# Altium schematic sheet Sheet1.SchDoc
size A; SheetNumber: 1; SheetTotal: 3; SPICEModelCacheGCVOIQGJ: <root> / <DocumentId>GCVOIQGJ</DocumentId> / </root>
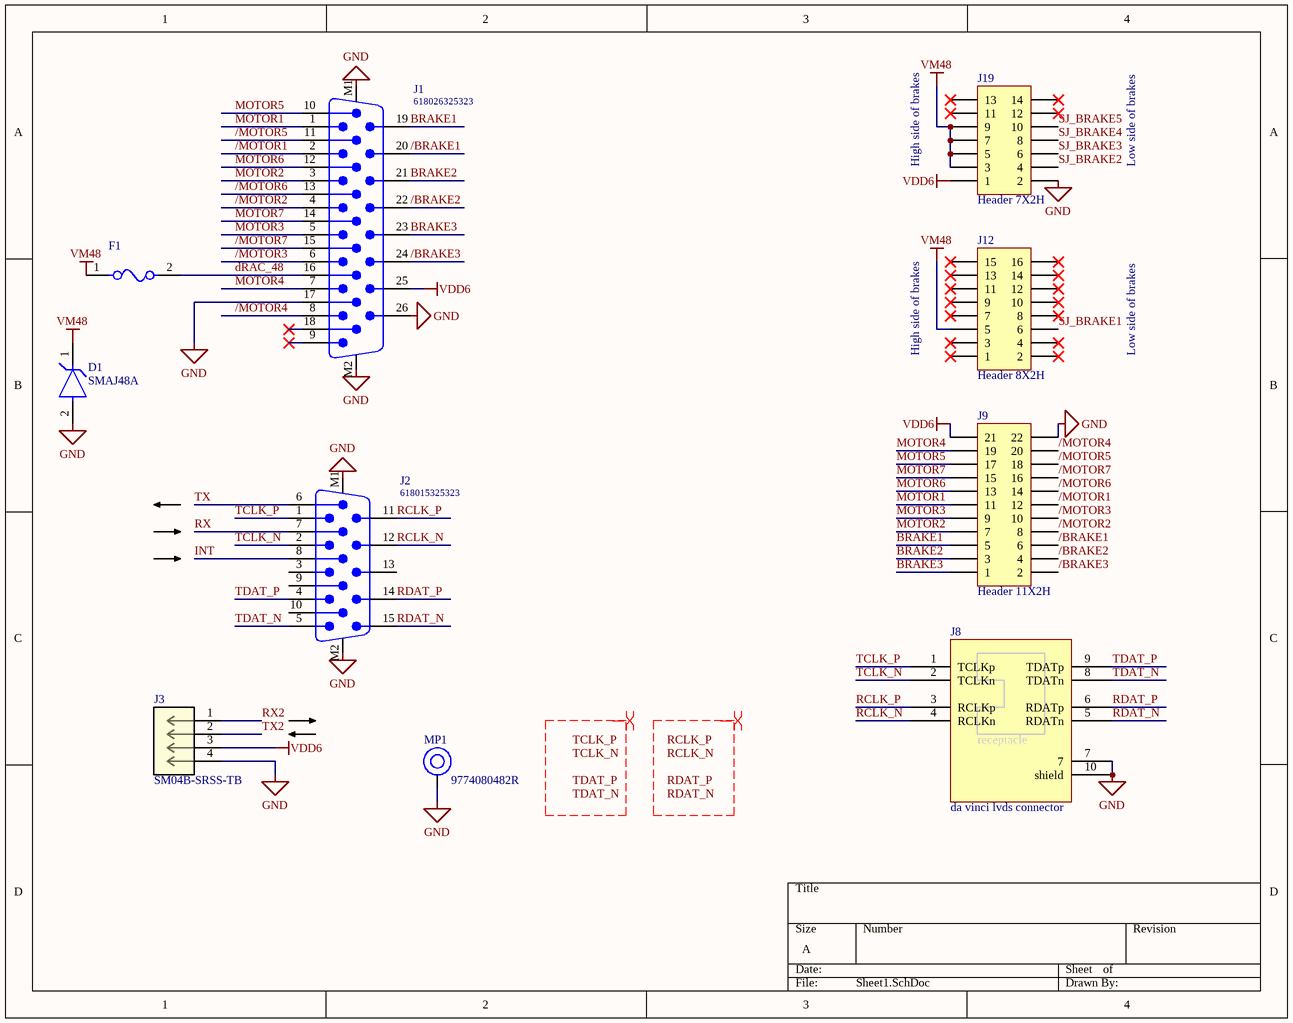
[diagram p0: Sheet1.SchDoc]

## Parts
D1  SMAJ48A  [FP-SMAJ-MFG]
F1  0466003.NR  [FP-0466-MFG]  (value not drawn)
J1  618026325323  [618026325323]
J2  618015325323  [618015325323]
J3  SM04B-SRSS-TB  [CONN_SM04B-SRSS-TB_JST]
J8  da vinci lvds connector  [1394b]
J9  Header 11X2H  [jst_pad22]
J12  Header 8X2H  [jst_pad16]
J19  Header 7X2H  [jst_pad14]
MP1  9774080482R  [9774080482]

## Nets
GND: D1.2(A) J1.17 J1.26 J1.M1 J1.M2 J2.M1 J2.M2 J3.4 J8.7 J8.10(shield) J9.22 J19.2 MP1.1
VDD6: J1.25 J3.3 J9.21 J19.1
VM48: D1.1(C) F1.1 J12.5 J19.3 J19.5 J19.7 J19.9
/BRAKE1: J1.20 J9.6
/BRAKE2: J1.22 J9.4
/BRAKE3: J1.24 J9.2
/MOTOR1: J1.2 J9.12
/MOTOR2: J1.4 J9.8
/MOTOR3: J1.6 J9.10
/MOTOR4: J1.8 J9.20
/MOTOR5: J1.11 J9.18
/MOTOR6: J1.13 J9.14
/MOTOR7: J1.15 J9.16
BRAKE1: J1.19 J9.5
BRAKE2: J1.21 J9.3
BRAKE3: J1.23 J9.1
dRAC_48: F1.2 J1.16
INT: J2.8
MOTOR1: J1.1 J9.11
MOTOR2: J1.3 J9.7
MOTOR3: J1.5 J9.9
MOTOR4: J1.7 J9.19
MOTOR5: J1.10 J9.17
MOTOR6: J1.12 J9.13
MOTOR7: J1.14 J9.15
RCLK_N: J2.12 J8.4(RCLKn)
RCLK_P: J2.11 J8.3(RCLKp)
RDAT_N: J2.15 J8.5(RDATn)
RDAT_P: J2.14 J8.6(RDATp)
RX: J2.7
RX2: J3.1
SJ_BRAKE1: J12.6
SJ_BRAKE2: J19.4
SJ_BRAKE3: J19.6
SJ_BRAKE4: J19.8
SJ_BRAKE5: J19.10
TCLK_N: J2.2 J8.2(TCLKn)
TCLK_P: J2.1 J8.1(TCLKp)
TDAT_N: J2.5 J8.8(TDATn)
TDAT_P: J2.4 J8.9(TDATp)
TX: J2.6
TX2: J3.2

Not connected (* = marked no-connect by the designer): J1 9* 18*; J2 3 9 10 13; J12 1* 2* 3* 4* 7* 8* 9* 10* 11* 12* 13* 14* 15* 16*; J19 11* 12* 13* 14*

## Layout directives
differential pair: RCLK_N, RCLK_P, RDAT_N, RDAT_P, TCLK_N, TCLK_P, TDAT_N, TDAT_P

## Notes on the sheet
- High side of brakes
- Low side of brakes
- Labels drawn without touching a wire or pin: RCLK_N, RCLK_P, RDAT_N, RDAT_P, TCLK_N, TCLK_P, TDAT_N, TDAT_P
- (in symbol davinci_lvds) receptacle

## Library data of the parts
D1 = CMP-07401-000001-1: TVS DIODE 48V 77.4V SMA; Manufacturer: Bourns Inc.; Direction: Unidirectional; Peak Pulse Current: 5.2A; Breakdown Voltage: 53.3V; Max Junction Temp: +150°C; Peak Pulse Power: 400W; Number Of Channels: 1; Mouser Description: TVS Diodes - Transient Voltage Suppressors 48volts 5uA 5.2 Amps Uni-Dir; Device Class L3: unset; Temperature Range Low: -55°C; Temperature Range High: +150°C; ComponentLink2URL: https://www.bourns.com/docs/product-datasheets/smaj.pdf?sfvrsn=d2266a96_9; Temperature: -55°C to +150°C; Category: Diode; Height: 2.29mm; Device Class L1: Circuit Protection; Lead Free: Yes; Digikey Description: TVS DIODE 48V 77.4V SMA; Package: SMAJ; Reverse Standoff Voltage: 48V; Automotive: No; Device Class L2: TVS Diodes; Octopart: https://octopart.com/smaj48a-bourns-12809387; ComponentLink2Description: Datasheet; RoHS: TRUE; Manufacturer Part Number: SMAJ48A; LCSC: C223991
F1 = CMP-08605-000054-1: FUSE BOARD MNT 3A 32VAC/VDC 1206; Manufacturer: Littelfuse; Fuse Interrupt Ac Current: 50A; Fuse Voltage Drop: 75.99mV; Max Fuse Ac Voltage: 32V; Fuse I2T: 0.576A2Sec; Resistance: 0.019Ω; Fuse Blow Speed: Fast; Value: 0.019Ω; ComponentLink2Description: Datasheet; Fuse Current: 3A; RoHS: TRUE; Mouser Description: Surface Mount Fuses 32V 3A VFA Slimline; Height: 0.66mm; Octopart: https://octopart.com/0466003.nr-littelfuse-565175; Package: 0466; Fuse Interrupt Dc Current: 50A; Manufacturer Part Number: 0466003.NR; Temperature Range Low: -55°C; ComponentLink2URL: https://www.littelfuse.com/~/media/electronics/datasheets/fuses/littelfuse_fuse_466_datasheet.pdf.pdf; Digikey Description: FUSE BOARD MNT 3A 32VAC/VDC 1206; Voltage Rating: 32V; Category: Fuse; Lead Free: Yes; Device Class L2: Fuses; Automotive: No; Max Fuse Dc Voltage: 32V; Temperature Range High: +90°C; Device Class L3: unset; Device Class L1: Circuit Protection; Temperature: -55°C to +90°C; LCSC: C182445
J1 = CMP-1502-00305-1: Male High Density PCB Connector without Hex Screw WR-DSUB, Angled, 26 pins; Manufacturer: Wurth Elektronik; Working Voltage: 60VAC; Rated Current: 3A; Pin Number: 26; Contact Resistance: 30mOhm; Operating Temperature: -40to85degC; Gender: Male; Datasheet URL: https://katalog.we-online.de/em/datasheet/6180xx325323.pdf; Package Reference: 618026325323; Part Number: 618026325323; Publisher: WurthElektronik; Manufacturer URL: http://www.we-online.de; Mounting Technology: THT; Packaging: Tray; Orientation: Angled
J2 = CMP-1502-00304-1: Male High Density PCB Connector without Hex Screw WR-DSUB, Angled, 15 pins; Manufacturer: Wurth Elektronik; Contact Resistance: 30mOhm; Pin Number: 15; Rated Current: 3A; Working Voltage: 60VAC; Packaging: Tray; Operating Temperature: -40to85degC; Datasheet URL: https://katalog.we-online.de/em/datasheet/6180xx325323.pdf; Package Reference: 618015325323; Manufacturer URL: http://www.we-online.de; Publisher: WurthElektronik; Mounting Technology: THT; Gender: Male; Orientation: Angled; Part Number: 618015325323
J3 = SM04B-SRSS-TB: No Description Available; Mfr_Name: JST; RefDes: RefDes; Type: Type; LCSC: C160404
J8 = davinci_lvds
J9 = Header 11X2H: Header, 11-Pin, Dual row, Right Angle; LatestRevisionDate: 17-Jul-2002; LatestRevisionNote: Re-released for DXP Platform.; Publisher: Altium Limited; LCSC: C5329908
J12 = Header 8X2H: Header, 8-Pin, Dual row, Right Angle; LatestRevisionDate: 17-Jul-2002; LatestRevisionNote: Re-released for DXP Platform.; Publisher: Altium Limited; LCSC: C2845842
J19 = Header 7X2H: Header, 7-Pin, Dual row, Right Angle; LatestRevisionDate: 17-Jul-2002; LatestRevisionNote: Re-released for DXP Platform.; Publisher: Altium Limited; LCSC: C2845841
MP1 = CMP-03913-89311603-1: 9774080482R WA-SMSI SMT Steel Spacer, M4 Internal non Stop; RoHS: Compliant; Width: 8.2mm; Length: 8mm; Max Operating Temperature: 150°C; NexarPartId: 89311603; Packaging: Tape and Reel; Min Operating Temperature: -55°C; Material: Steel